# EAGLE design firefly (EAGLE 5.10)
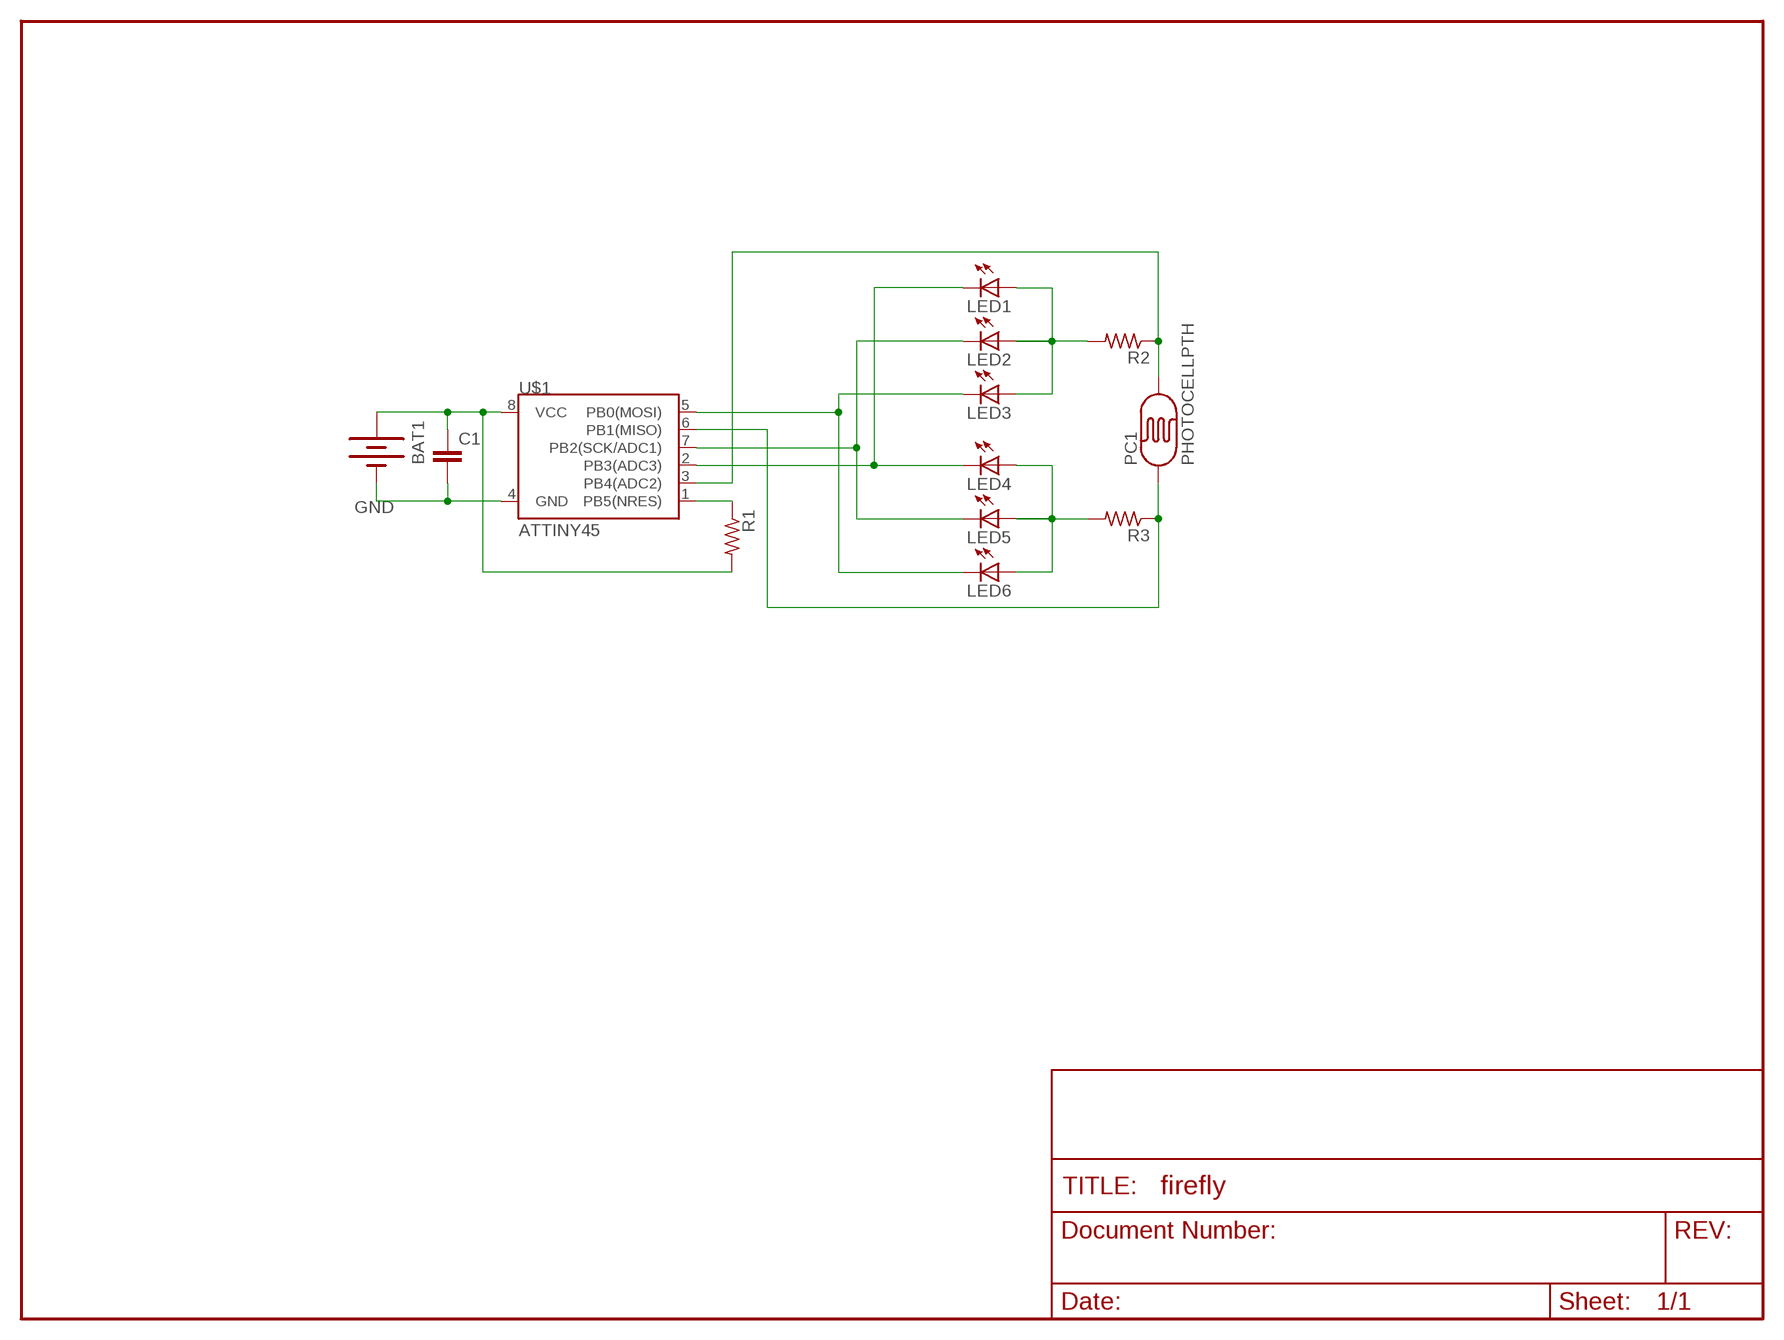
[diagram p0: schematic, sheet 1]

## Parts
BAT1  BATTERY20PTH  [BATTCOM_20MM_PTH]
C1  CAP0805  [R0805]
LED1  LED0805  [LED-0805]
LED2  LED0805  [LED-0805]
LED3  LED0805  [LED-0805]
LED4  LED0805  [LED-0805]
LED5  LED0805  [LED-0805]
LED6  LED0805  [LED-0805]
PC1  PHOTOCELLPTH  [PHOTOCELL]
R1  R-US_R0805  [R0805]
R2  R-US_R0805  [R0805]
R3  R-US_R0805  [R0805]
U$1  ATTINY45  [SO08-EIAJ]

## Nets
GND: BAT1.2(-) C1.2 U$1.4(GND)
N$1: R1.1 U$1.1(PB5(NRES))
N$4: PC1.1 R3.1 U$1.6(PB1(MISO))
N$5: LED1.A LED2.A LED3.A R2.2
N$6: LED4.A LED5.A LED6.A R3.2
N$7: LED1.C LED4.C U$1.2(PB3(ADC3))
N$8: LED2.C LED5.C U$1.7(PB2(SCK/ADC1))
N$9: LED3.C LED6.C U$1.5(PB0(MOSI))
N$10: PC1.2 R2.1 U$1.3(PB4(ADC2))
VBATT: BAT1.1(+) C1.1 R1.2 U$1.8(VCC)

## Library data of the parts
BAT1 = firefly:BATTERY: Battery Holders Various common sizes : AA, AAA, 20mm coin cell and 12mm coin cell.
C1 = firefly:CAP: Capacitor Standard 0603 ceramic capacitor, and 0.1" leaded capacitor.
LED1-LED6 = firefly:LED: LEDs Standard schematic elements and footprints for 5mm, 3mm, 1206, and 0603 sized LEDs. 5mm - Spark Fun Electronics SKU : COM-00529 (and others)
PC1 = firefly:PHOTOCELL
R1-R3 = firefly:R-US_: RESISTOR, American symbol
U$1 = firefly:ATTINY45: Atmel ATTiny45

## Board
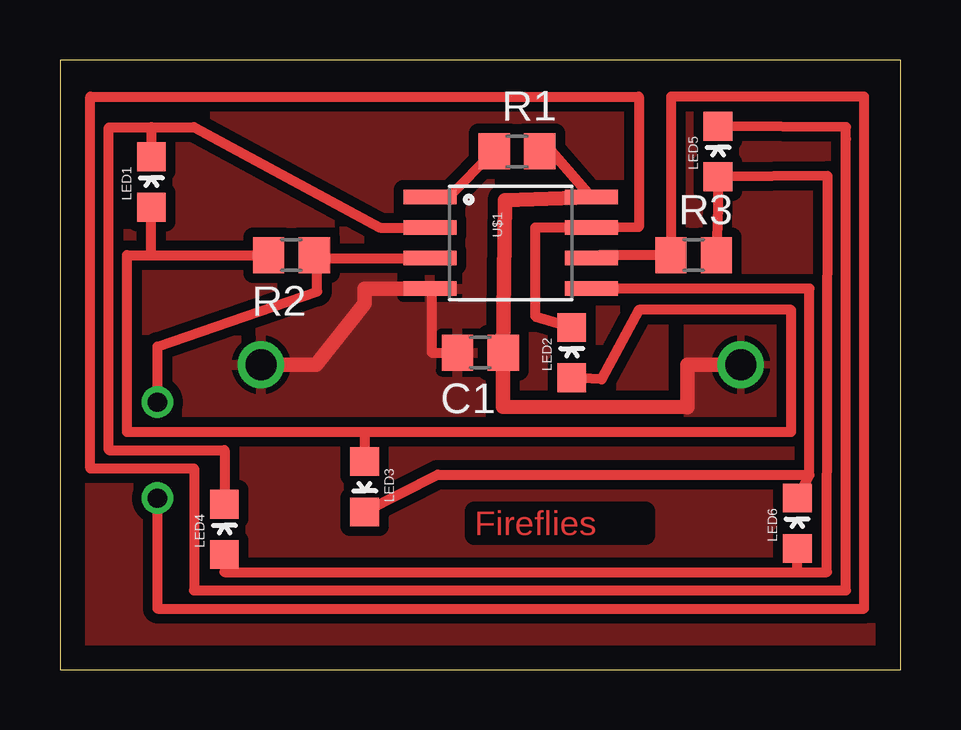
[diagram p1: board, top side]
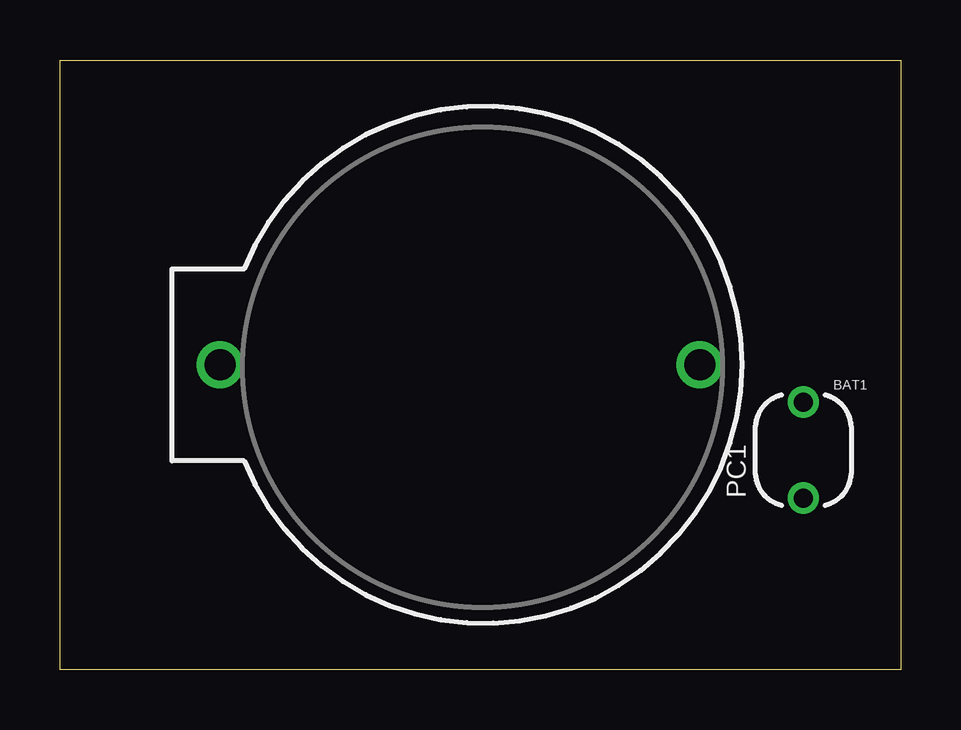
[diagram p2: board, bottom side, seen from below]

Size 35.05 x 25.4 mm. Coordinates in mm from the lower left corner, seen from the top.
Outline: 0,0 35.05,0 35.05,25.4 0,25.4 0,0
Copper layers (1*16): Top 0.035mm / dielectric 1.5mm / Bottom 0.035mm
Design rules "default": minimum track width 10mil, minimum drill 0.6mm, track to track 8mil, track to pad 8mil, pad to pad 8mil, via to via 8mil, smd to smd 8mil, copper to edge 40mil, drill to drill 8mil, minimum pad ring 10mil, minimum via ring 8mil, stop-mask expansion 4mil, vias tented up to drill 0mil, thermal gap 10mil

### Footprints (pad centres in the part's own frame; a part is rotated, then mirrored left to right if it is on the bottom)
BATTCOM_20MM_PTH = drill 1.295 round: 1 20,0; 2 0,0
R0805 = smd 1.3 x 1.5: 1 -0.95,0; 2 0.95,0
LED-0805 = smd 1.2 x 1.2: A 0,-1.05; C 0,1.05
PHOTOCELL = drill 0.8 round: 1 -2,0; 2 2,0
SO08-EIAJ = smd 0.61 x 2.21: 1 -1.905,-3.378; 2 -0.635,-3.378; 3 0.635,-3.378; 4 1.905,-3.378; 5 1.905,3.353; 6 0.635,3.353; 7 -0.635,3.353; 8 -1.905,3.353

### Placement (x,y rotation side)
BAT1  8.38,12.7 180 bottom
C1  17.53,13.21 180 top
LED1  3.81,20.32 0 top
LED2  21.34,13.21 0 top
LED3  12.7,7.62 180 top
LED4  6.86,5.84 0 top
LED5  27.43,21.59 0 top
LED6  30.73,6.1 0 top
PC1  4.06,9.14 90 bottom
R1  19.05,21.59 0 top
R2  9.65,17.27 180 top
R3  26.42,17.27 0 top
U$1  18.8,17.78 270 top

### Tracks (layer width: path | path; a pad name or v marks a point on that pad's centre or on a via)
GND
  Top 0.406: C1.2 15.49,13.21 15.49,15.88 U$1.4
  Top 0.61: BAT1.2 10.67,12.7 12.7,15.24 12.7,15.88 U$1.4
  pour Top (isolate 0.406): 0,25.15 33.78,25.15 33.78,15.75 25.15,15.75 25.15,9.4 33.78,9.4 33.78,0 0,0
N$1
  Top 0.406: U$1.1 16.2,19.68 R1.1
N$4
  Top 0.406: U$1.6 22.53,17.27 R3.1 25.48,23.88 33.53,23.88 33.53,2.54 4.06,2.54 PC1.1
N$5
  Top 0.406: 3.81,17.27 LED1.A | LED2.A 22.58,12.09 24.13,14.99 30.48,14.99 30.48,9.91 12.7,9.91 | 12.7,9.91 12.45,9.91 2.79,9.91 2.79,17.27 3.81,17.27 | 12.7,9.91 LED3.A | 3.81,17.27 R2.2
N$6
  Top 0.406: 30.73,4.06 31.98,4.06 32,20.57 LED5.A 27.43,19.3 R3.2 | 30.73,4.06 LED6.A 30.73,4.06 | LED4.A 6.86,4.06 30.73,4.06
N$7
  Top 0.406: U$1.2 13.34,18.41 5.59,22.61 3.82,22.61 LED1.C 3.81,22.61 3.81,22.59 2.03,22.59 2.03,9.14 6.86,9.14 LED4.C
N$8
  Top 0.406: LED5.C 32.77,22.61 32.77,22.1 32.77,3.3 5.59,3.3 5.59,8.38 1.27,8.38 1.27,23.88 24.13,23.88 24.13,18.44 U$1.7 19.81,18.41 19.81,14.73 LED2.C
N$9
  Top 0.406: 31.24,8.12 LED6.C | LED3.C 15.75,8.13 31.24,8.12 | U$1.5 31.24,15.88 31.24,8.12
N$10
  Top 0.406: 10.73,17.14 U$1.3 | 10.73,17.14 R2.1 | 10.73,17.14 10.73,15.75 4.06,13.46 PC1.2
VBATT
  Top 0.406: U$1.8 20.5,21.59 R1.2 20.32,21.91 | 28.45,12.7 BAT1.1 28.45,12.7
  Top 0.61: 28.45,12.7 26.16,12.7 26.16,11.94 26.16,10.92 18.47,10.95 C1.1 18.54,19.56 U$1.8
  pour Top (isolate 0.406): 26.16,14.99 30.48,14.99 30.48,10.16 26.16,10.16

### Text on the board
Top: Fireflies